# EAGLE design 2back-1motor (EAGLE 9.6.2)
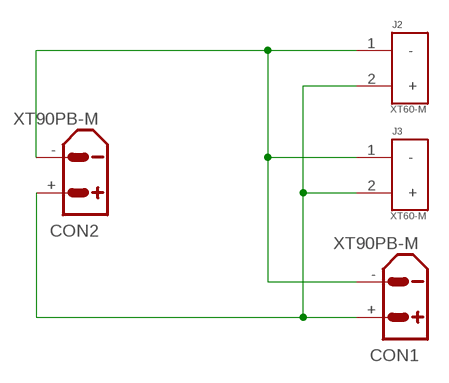
[diagram p0: schematic, sheet 1]

## Parts
CON1  XT90PB-M  [XT90PB-M]
CON2  XT90PB-M  [XT90PB-M]
J2  XT60-M  [AMASS_XT60-M]
J3  XT60-M  [AMASS_XT60-M]

## Nets
N$1: CON1.- CON2.- J2.1(-) J3.1(-)
N$2: CON1.+ CON2.+ J2.2(+) J3.2(+)

## Library data of the parts
CON1 CON2 = amass:XT90: AMASS XT90 connector Store in Japan AMASS XT90 connector <https://szc.jp/ams-xt90>
J2 J3 = XT60-M:XT60-M: DC supply; XT60; male; PIN:2; for cable; soldered; 60A; 500V; AVAILABILITY: Unavailable; DESCRIPTION: Plug; DC supply; XT60; male; PIN: 2; for cable; soldered; 30A; 500V; MF: AMASS; MP: XT60-M; PACKAGE: Package; PRICE: None

## Board
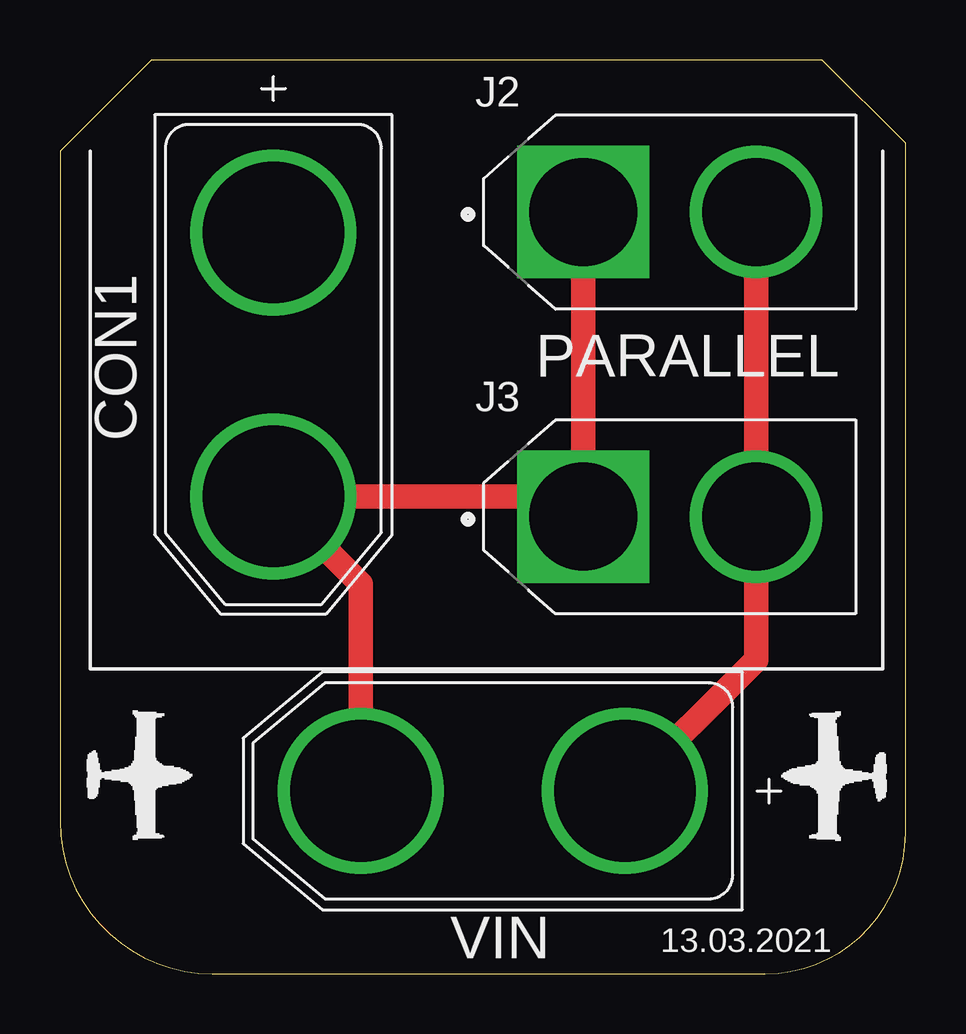
[diagram p1: board, top side]
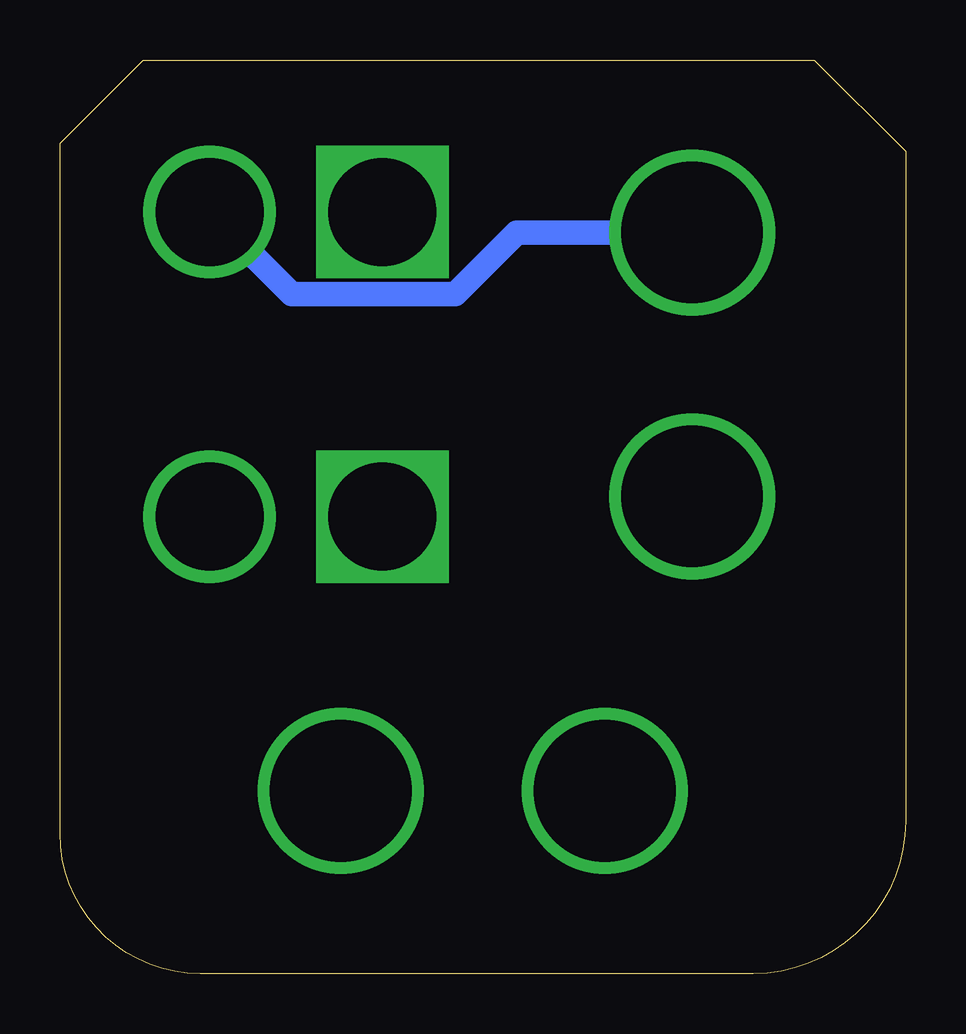
[diagram p2: board, bottom side, seen from below]

Size 35.23 x 38.09 mm. Coordinates in mm from the lower left corner, seen from the top.
Outline: 0,34.29 0,6.35 arc90 6.35,0 29.38,0 arc90 35.23,5.85 35.23,34.62 31.76,38.09 3.8,38.09 0,34.29
Copper layers (1*16): Top 0.035mm / dielectric 1.5mm / Bottom 0.035mm
Design rules "default": minimum track width 6mil, minimum drill 0.35mm, track to track 6mil, track to pad 6mil, pad to pad 6mil, via to via 6mil, smd to smd 6mil, copper to edge 40mil, drill to drill 6mil, minimum pad ring 10mil, minimum via ring 8mil, stop-mask expansion 4mil, vias tented up to drill 0mil, thermal gap 10mil

### Footprints (pad centres in the part's own frame; a part is rotated, then mirrored left to right if it is on the bottom)
XT90PB-M = drill 5.9: + 5.5,0; - -5.5,0
AMASS_XT60-M = drill 4.5 square: 1 -3.6,0 | drill 4.5: 2 3.6,0

### Placement (x,y rotation side)
CON1  8.89,25.4 90 top
CON2  18.03,7.62 0 top
J2  25.4,31.75 0 top
J3  25.4,19.05 0 top

### Tracks (layer width: path | path; a pad name or v marks a point on that pad's centre or on a via)
N$1
  Top 1.016: CON2.- 12.53,16.26 CON1.- 20.95,19.9 J3.1 J2.1
N$2
  Top 1.016: CON2.+ 29,13.09 J3.2 J2.2
  Bottom 1.016: CON1.+ 16.2,30.9 18.77,28.33 25.58,28.33 J2.2

### Text on the board
tNames: PARALLEL | VIN | 13.03.2021